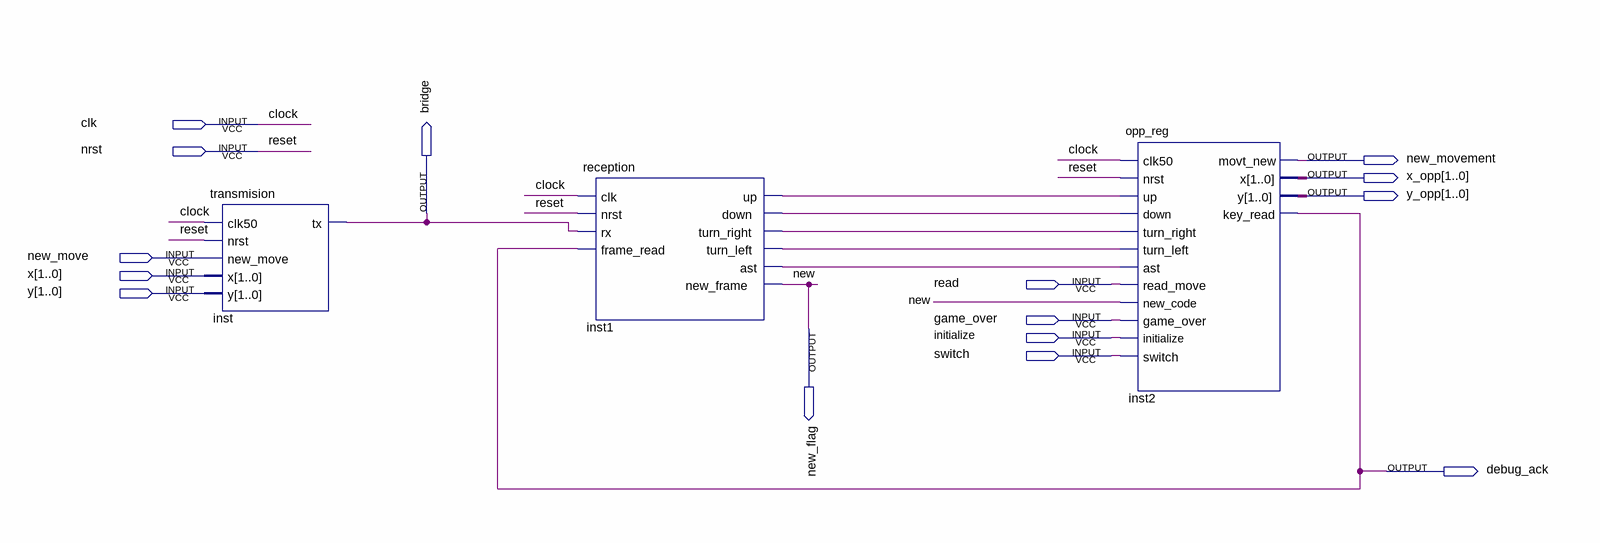
[diagram p0: schematic sheet]
// Quartus schematic tx_rx_reg.bdf as structural Verilog: 3 symbols, 15 pins
module tx_rx_reg (
  input  clk,
  input  nrst,
  input  new_move,
  input  [1:0] x,
  input  read,
  input  [1:0] y,
  input  game_over,
  input  initialize,
  input  switch,
  output new_movement,
  output [1:0] x_opp,
  output [1:0] y_opp,
  output bridge,
  output new_flag,
  output debug_ack
);

  wire inst1_ast, inst1_down, inst1_turn_left, inst1_turn_right, inst1_up;

  transmision inst (.clk50(clk), .nrst(nrst), .new_move(new_move), .x(x), .y(y), .tx(bridge));
  reception inst1 (
    .clk(clk), .nrst(nrst), .rx(bridge), .frame_read(debug_ack), .up(inst1_up), .down(inst1_down),
    .turn_right(inst1_turn_right), .turn_left(inst1_turn_left), .ast(inst1_ast), .new_frame(new_flag));
  opp_reg inst2 (
    .clk50(clk), .nrst(nrst), .up(inst1_up), .down(inst1_down), .turn_right(inst1_turn_right),
    .turn_left(inst1_turn_left), .ast(inst1_ast), .read_move(read), .new_code(new_flag),
    .game_over(game_over), .initialize(initialize), .switch(switch), .movt_new(new_movement), .x(x_opp),
    .y(y_opp), .key_read(debug_ack));

  // Other names for the same wires on the sheet: clock = clk; new = new_flag; reset = nrst
endmodule
